# EAGLE schematic SCHEDA_0.1 (EAGLE 8.1.1)
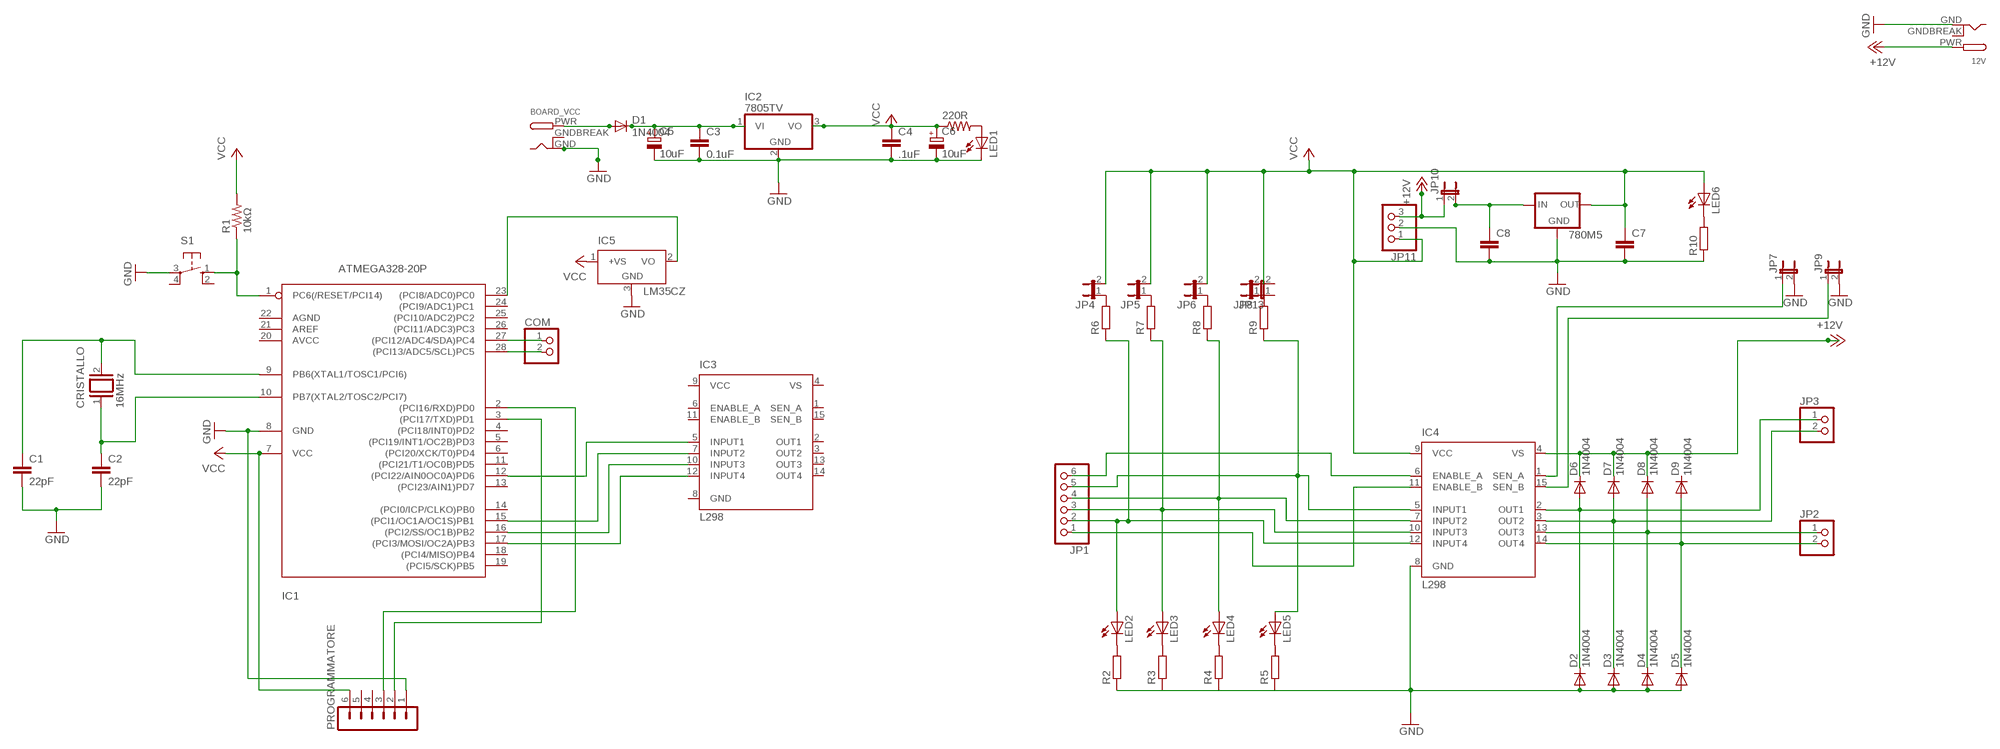
[diagram p0: schematic, sheet 1]

## Parts
12V  DCBARRELPTH  [DCJACK_2MM_PTH]
220R  R-US_0204/7  [0204/7]
780M5  78XXS  [78XXS]
BOARD_VCC  DCBARRELPTH  [DCJACK_2MM_PTH]
C1  22pF  C5/3  [C5B3]
C2  22pF  C5/3  [C5B3]
C3  0.1uF  C-EU025-024X044  [C025-024X044]
C4  .1uF  C-EU025-024X044  [C025-024X044]
C5  10uF  CPOL-EUE1.8-4  [E1,8-4]
C6  10uF  CPOL-EUE1.8-4  [E1,8-4]
C7  C-EU025-025X050  [C025-025X050]
C8  C-EU025-025X050  [C025-025X050]
COM  PINHD-1X2  [1X02]
CRISTALLO  16MHz  XTAL/S  [QS]
D1  1N4004  [DO41-10]
D2  1N4004  [DO41-10]
D3  1N4004  [DO41-10]
D4  1N4004  [DO41-10]
D5  1N4004  [DO41-10]
D6  1N4004  [DO41-10]
D7  1N4004  [DO41-10]
D8  1N4004  [DO41-10]
D9  1N4004  [DO41-10]
IC1  ATMEGA328-20P  [DIL28-3]
IC2  7805TV  [TO220V]
IC3  L298  [MULTIWATT-15]
IC4  L298  [MULTIWATT-15]
IC5  LM35CZ  [TO92]
JP1  PINHD-1X6  [1X06]
JP2  PINHD-1X2  [1X02]
JP3  PINHD-1X2  [1X02]
JP4  JP1E  [JP1]
JP5  JP1E  [JP1]
JP6  JP1E  [JP1]
JP7  JP1E  [JP1]
JP8  JP1E  [JP1]
JP9  JP1E  [JP1]
JP10  JP1E  [JP1]
JP11  PINHD-1X3  [1X03]
JP13  JP1E  [JP1]
LED1  LED3MM  [LED3MM]
LED2  LED5MM  [LED5MM]
LED3  LED5MM  [LED5MM]
LED4  LED5MM  [LED5MM]
LED5  LED5MM  [LED5MM]
LED6  LED5MM  [LED5MM]
PROGRAMMATORE  MA06-1  [MA06-1]
R1  10kΩ  R-US_0207/10  [0207/10]
R2  R-EU_0207/7  [0207/7]
R3  R-EU_0207/7  [0207/7]
R4  R-EU_0207/7  [0207/7]
R5  R-EU_0207/7  [0207/7]
R6  R-EU_0207/7  [0207/7]
R7  R-EU_0207/7  [0207/7]
R8  R-EU_0207/7  [0207/7]
R9  R-EU_0207/7  [0207/7]
R10  R-EU_0207/10  [0207/10]
S1  40-XX  [B3F-40XX]

## Nets
+12V: D6.C D7.C D8.C IC4.4(VS) JP10.1 JP11.3
-: COM.1 IC1.27((PCI12/ADC4/SDA)PC4)
GND: 12V.GND 780M5.GND BOARD_VCC.GND C1.2 C2.2 C3.2 C4.2 C5.- C6.- C7.2 C8.2 D2.A D3.A D4.A D5.A IC1.8(GND) IC2.2(GND) IC4.8(GND) IC5.3(GND) JP7.2 JP9.2 JP11.2 LED1.K(C) PROGRAMMATORE.1 R2.1 R10.1 S1.3(P)
N$1: C1.1 CRISTALLO.2 IC1.9(PB6(XTAL1/TOSC1/PCI6))
N$2: C2.1 CRISTALLO.1 IC1.10(PB7(XTAL2/TOSC2/PCI7))
N$3: IC1.1(PC6(/RESET/PCI14)) R1.1 S1.1(S)
N$4: IC1.15((PCI1/OC1A/OC1S)PB1) IC3.7(INPUT2)
N$5: IC1.3((PCI17/TXD)PD1) PROGRAMMATORE.2
N$6: C3.1 C5.+ D1.C IC2.1(VI)
N$7: IC1.2((PCI16/RXD)PD0) PROGRAMMATORE.3
N$8: IC1.16((PCI2/SS/OC1B)PB2) IC3.10(INPUT3)
N$9: COM.2 IC1.28((PCI13/ADC5/SCL)PC5)
N$10: IC1.17((PCI3/MOSI/OC2A)PB3) IC3.12(INPUT4)
N$11: IC1.12((PCI22/AIN0OC0A)PD6) IC3.5(INPUT1)
N$12: IC4.6(ENABLE_A) JP1.6
N$13: IC4.5(INPUT1) JP1.5 LED5.A R9.1
N$14: IC4.7(INPUT2) JP1.4 LED4.A R8.1
N$15: IC4.10(INPUT3) JP1.3 LED3.A R7.1
N$16: IC4.12(INPUT4) JP1.2 LED2.A R6.1
N$17: IC4.11(ENABLE_B) JP1.1
N$18: LED2.K(C) R2.2
N$19: LED3.K(C) R3.2
N$20: LED4.K(C) R4.2
N$21: BOARD_VCC.PWR D1.A
N$22: LED5.K(C) R5.2
N$23: 220R.2 LED1.A
N$24: D5.C D9.A IC4.14(OUT4) JP2.2
N$25: D4.C D8.A IC4.13(OUT3) JP2.1
N$26: D3.C D7.A IC4.3(OUT2) JP3.2
N$27: D2.C D6.A IC4.2(OUT1) JP3.1
N$28: JP4.1 R6.2
N$29: JP5.1 R7.2
N$30: JP6.1 R8.2
N$31: JP8.1 R9.2
N$32: IC4.1(SEN_A) JP7.1
N$33: IC4.15(SEN_B) JP9.1
N$34: LED6.K(C) R10.2
N$35: 780M5.IN C8.1 JP10.2
N$36: 12V.PWR
N$37: IC1.23((PCI8/ADC0)PC0) IC5.2(VO)
VCC: 220R.1 780M5.OUT C4.1 C6.+ C7.1 IC1.7(VCC) IC2.3(VO) IC4.9(VCC) IC5.1(+VS) JP4.2 JP5.2 JP6.2 JP8.2 JP11.1 LED6.A PROGRAMMATORE.6 R1.2
Unconnected: D9.C IC1.4((PCI18/INT0)PD2) IC1.5((PCI19/INT1/OC2B)PD3) IC1.6((PCI20/XCK/T0)PD4) IC1.11((PCI21/T1/OC0B)PD5) IC1.13((PCI23/AIN1)PD7) IC1.14((PCI0/ICP/CLKO)PB0) IC1.18((PCI4/MISO)PB4) IC1.19((PCI5/SCK)PB5) IC1.20(AVCC) IC1.21(AREF) IC1.22(AGND) IC1.24((PCI9/ADC1)PC1) IC1.25((PCI10/ADC2)PC2) IC1.26((PCI11/ADC3)PC3) IC3.1(SEN_A) IC3.2(OUT1) IC3.3(OUT2) IC3.6(ENABLE_A) IC3.11(ENABLE_B) IC3.13(OUT3) IC3.14(OUT4) IC3.15(SEN_B) JP13.1 JP13.2 PROGRAMMATORE.4 PROGRAMMATORE.5 R3.1 R4.1 R5.1 S1.2(S1) S1.4(P1)

## Power pins joined to a net without a drawn wire
GND: IC3.8(GND)
GNDBREAK: 12V.GNDBREAK BOARD_VCC.GNDBREAK
VCC: IC3.9(VCC)
VS: IC3.4(VS)

## Library data of the parts
12V BOARD_VCC = adafruit:DCBARREL: 2.0mm DC Barrel Jack DCJACK_2MM_PTH - Through Hole Jack (4UConnector: 05537)
220R = rcl:R-US_: RESISTOR, American symbol
780M5 = v-reg:78XXS: VOLTAGE REGULATOR
C1 C2 = capacitor-wima:C: CAPACITOR naming: grid - package width
C3 C4 C7 C8 = rcl:C-EU: CAPACITOR, European symbol
C5 C6 = rcl:CPOL-EU: POLARIZED CAPACITOR, European symbol
COM JP2 JP3 = pinhead:PINHD-1X2: PIN HEADER
CRISTALLO = special:XTAL/S: CRYSTAL
D1-D9 = adafruit:1N4004: DIODE General purpose 1N400x type rectifier (With bigger pads) http://www.ladyada.net/library/pcb/eaglelibrary.html
IC1 = atmega328:ATMEGA328*P: MICROCONTROLLER 32 kBytes FLASH 2 kBytes SRAM 1 kBytes EEPROM USART 8-channel 10 bit ADC
IC2 = linear:78*: Positive VOLTAGE REGULATOR Source: http://cache.national.com/ds/LM/LM78L05.pdf http://www.fairchildsemi.com/ds/LM/LM7805.pdf
IC3 IC4 = st-microelectronics:L298: DUAL FULL-BRIDGE DRIVER; MPN: L298N; OC_FARNELL: 1589425; OC_NEWARK: 32M1527
IC5 = lm35:LM35: Single-Supply Centigrade Temperature Sensor Vout = (10mV/°C x Temp °C) +5mmmV Source: http://www.national.com/ds/LM/LM35.pdf
JP1 = adafruit:PINHD-1X6: PIN HEADER
JP4-JP10 JP13 = jumper:JP1E: JUMPER
JP11 = pinhead:PINHD-1X3: PIN HEADER
LED1 = led:LED: LED
LED2-LED6 = adafruit:LED: LED
PROGRAMMATORE = con-lstb:MA06-1: PIN HEADER; OC_FARNELL: unknown; OC_NEWARK: unknown
R1 = adafruit:R-US_: RESISTOR, American symbol
R2-R10 = resistor:R-EU_: RESISTOR, European symbol
S1 = switch-omron:40-XX: OMRON SWITCH; MF: OMRON COMPONENTS USA; MPN: B3F-4000; OC_FARNELL: 176434; OC_NEWARK: 36K3105